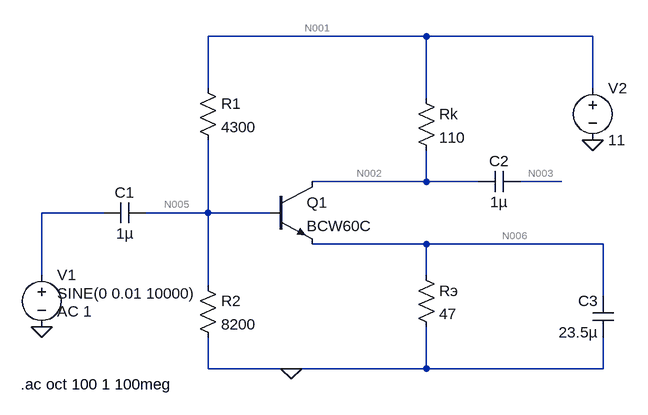
[diagram p0: schematic task3.asc]
task3.asc, the LTspice schematic file:
Version 4
SHEET 1 880 680
WIRE 32 -48 -304 -48
WIRE 288 -48 32 -48
WIRE -304 32 -304 -48
WIRE 288 32 288 -48
WIRE 32 48 32 -48
WIRE 32 176 32 128
WIRE 32 176 -144 176
WIRE 112 176 32 176
WIRE 240 176 176 176
WIRE -464 224 -560 224
WIRE -304 224 -304 112
WIRE -304 224 -400 224
WIRE -208 224 -304 224
WIRE 32 272 -144 272
WIRE 304 272 32 272
WIRE -560 320 -560 224
WIRE 32 320 32 272
WIRE -304 336 -304 224
WIRE 304 352 304 272
WIRE -304 464 -304 416
WIRE -176 464 -304 464
WIRE 32 464 32 400
WIRE 32 464 -176 464
WIRE 304 464 304 416
WIRE 304 464 32 464
FLAG -560 400 0
FLAG 288 112 0
FLAG -176 464 0
SYMBOL res -320 320 R0
SYMATTR InstName R2
SYMATTR Value 8200
SYMBOL res 16 32 R0
SYMATTR InstName Rk
SYMATTR Value 110
SYMBOL res 16 304 R0
SYMATTR InstName Rэ
SYMATTR Value 47
SYMBOL voltage -560 304 R0
WINDOW 3 24 44 Left 2
WINDOW 123 24 72 Left 2
WINDOW 39 0 0 Left 0
SYMATTR Value SINE(0 0.01 10000)
SYMATTR Value2 AC 1
SYMATTR InstName V1
SYMBOL cap -400 208 R90
WINDOW 0 0 32 VBottom 2
WINDOW 3 32 32 VTop 2
SYMATTR InstName C1
SYMATTR Value 1µ
SYMBOL cap 176 160 R90
WINDOW 0 0 32 VBottom 2
WINDOW 3 32 32 VTop 2
SYMATTR InstName C2
SYMATTR Value 1µ
SYMBOL cap 320 416 R180
WINDOW 0 24 56 Left 2
WINDOW 3 24 8 Left 2
SYMATTR InstName C3
SYMATTR Value 23.5µ
SYMBOL npn -208 176 R0
SYMATTR InstName Q1
SYMATTR Value BCW60C
SYMBOL res -320 16 R0
SYMATTR InstName R1
SYMATTR Value 4300
SYMBOL voltage 288 16 R0
WINDOW 123 0 0 Left 0
WINDOW 39 0 0 Left 0
SYMATTR InstName V2
SYMATTR Value 11
TEXT -592 488 Left 2 !.ac oct 100 1 100meg

The netlist it stands for:
* task3.asc
R2 N005 0 8200
Rk N001 N002 110
Rэ N006 0 47
V1 N004 0 SINE(0 0.01 10000) AC 1
C1 N005 N004 1µ
C2 N003 N002 1µ
C3 0 N006 23.5µ
Q1 N002 N005 N006 0 BCW60C
R1 N001 N005 4300
V2 N001 0 11
.model NPN NPN
.model PNP PNP
.lib standard.bjt
.ac oct 100 1 100meg
.backanno
.end

* Results of the author's LTspice run, read from the files saved beside the schematic
* Operating Point, zero values left out:
*   V(n005) = 4.057 V
*   V(n001) = 11 V
*   V(n002) = 3.571 V
*   V(n006) = 3.227 V
*   V(n003) = 3.571 µV
*   Ic(Q1) = 67.54 mA
*   Ib(Q1) = 1.12 mA
*   Ie(Q1) = -68.66 mA
*   I(R1) = 1.615 mA
*   I(Rэ) = 68.66 mA
*   I(Rk) = 67.54 mA
*   I(R2) = 494.7 µA
*   I(V2) = -69.15 mA
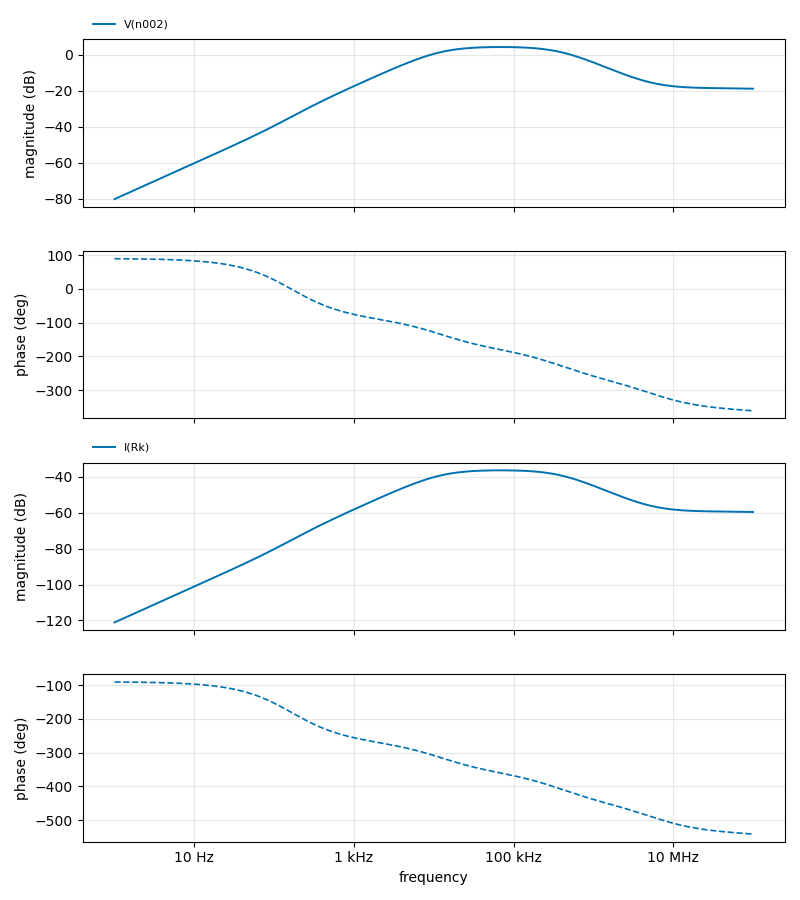
[diagram p1: AC Analysis of task3.asc, plotted from the saved traces]
* AC Analysis, 1 run:
*   V(n002): -80.30 dB at 1 Hz, -18.79 dB at 100 MHz, peak 4.40 dB at 68.79 kHz, 3 dB below the peak at 11.75 kHz and 406.4 kHz
*   I(Rk): -121.13 dB at 1 Hz, -59.62 dB at 100 MHz, peak -36.42 dB at 68.79 kHz, 3 dB below the peak at 11.75 kHz and 406.4 kHz